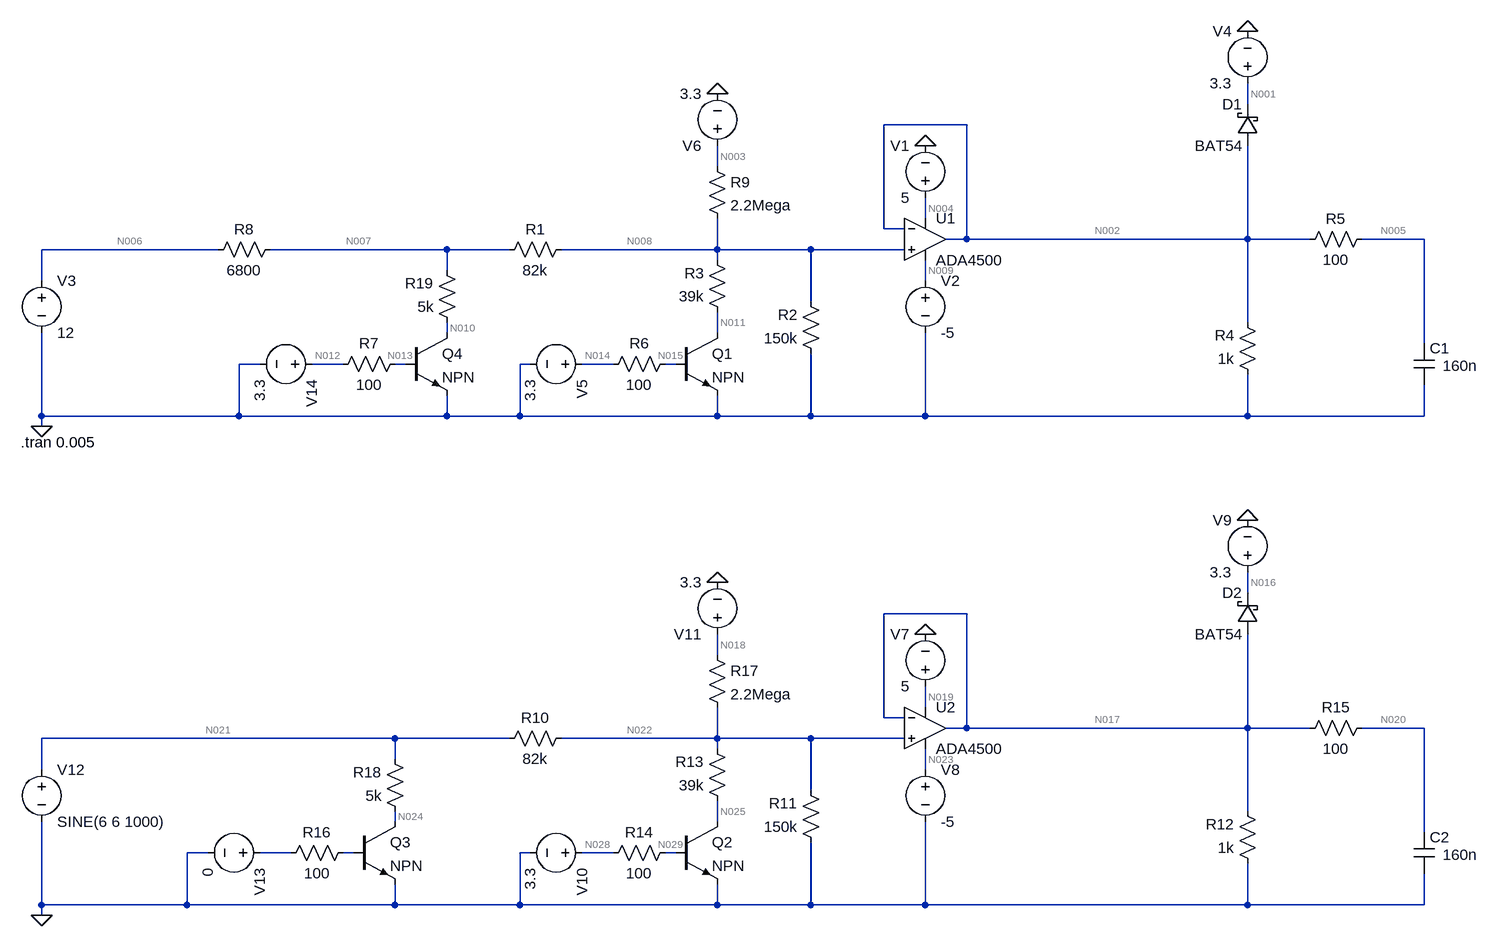
[diagram p0: schematic AnalogFrontend.asc]
AnalogFrontend.asc, the LTspice schematic file:
Version 4
SHEET 1 1180 1176
WIRE 752 -112 752 -144
WIRE 320 -80 192 -80
WIRE -64 -16 -64 -48
WIRE 256 64 256 32
WIRE 192 80 192 -80
WIRE 224 80 192 80
WIRE 320 96 320 -80
WIRE 320 96 288 96
WIRE 752 96 752 -48
WIRE 752 96 320 96
WIRE 848 96 752 96
WIRE 1024 96 928 96
WIRE -832 112 -1104 112
WIRE -480 112 -752 112
WIRE -384 112 -480 112
WIRE -64 112 -64 64
WIRE -64 112 -304 112
WIRE 80 112 -64 112
WIRE 224 112 80 112
WIRE -64 128 -64 112
WIRE -480 144 -480 112
WIRE -1104 160 -1104 112
WIRE 256 160 256 128
WIRE 80 192 80 112
WIRE 752 224 752 96
WIRE -480 240 -480 224
WIRE -64 240 -64 208
WIRE 1024 256 1024 96
WIRE -768 288 -800 288
WIRE -640 288 -688 288
WIRE -544 288 -560 288
WIRE -352 288 -368 288
WIRE -224 288 -272 288
WIRE -128 288 -144 288
WIRE -1104 368 -1104 240
WIRE -800 368 -800 288
WIRE -800 368 -1104 368
WIRE -480 368 -480 336
WIRE -480 368 -800 368
WIRE -368 368 -368 288
WIRE -368 368 -480 368
WIRE -64 368 -64 336
WIRE -64 368 -368 368
WIRE 80 368 80 272
WIRE 80 368 -64 368
WIRE 256 368 256 240
WIRE 256 368 80 368
WIRE 752 368 752 304
WIRE 752 368 256 368
WIRE 1024 368 1024 320
WIRE 1024 368 752 368
WIRE -1104 384 -1104 368
WIRE 752 640 752 608
WIRE 320 672 192 672
WIRE -64 736 -64 704
WIRE 256 816 256 784
WIRE 192 832 192 672
WIRE 224 832 192 832
WIRE 320 848 320 672
WIRE 320 848 288 848
WIRE 752 848 752 704
WIRE 752 848 320 848
WIRE 848 848 752 848
WIRE 1024 848 928 848
WIRE -560 864 -1104 864
WIRE -384 864 -560 864
WIRE -64 864 -64 816
WIRE -64 864 -304 864
WIRE 80 864 -64 864
WIRE 224 864 80 864
WIRE -64 880 -64 864
WIRE -560 896 -560 864
WIRE -1104 912 -1104 864
WIRE 256 912 256 880
WIRE 80 944 80 864
WIRE 752 976 752 848
WIRE -560 992 -560 976
WIRE -64 992 -64 960
WIRE 1024 1008 1024 848
WIRE -848 1040 -880 1040
WIRE -720 1040 -768 1040
WIRE -624 1040 -640 1040
WIRE -352 1040 -368 1040
WIRE -224 1040 -272 1040
WIRE -128 1040 -144 1040
WIRE -1104 1120 -1104 992
WIRE -880 1120 -880 1040
WIRE -880 1120 -1104 1120
WIRE -560 1120 -560 1088
WIRE -560 1120 -880 1120
WIRE -368 1120 -368 1040
WIRE -368 1120 -560 1120
WIRE -64 1120 -64 1088
WIRE -64 1120 -368 1120
WIRE 80 1120 80 1024
WIRE 80 1120 -64 1120
WIRE 256 1120 256 992
WIRE 256 1120 80 1120
WIRE 752 1120 752 1056
WIRE 752 1120 256 1120
WIRE 1024 1120 1024 1072
WIRE 1024 1120 752 1120
WIRE -1104 1136 -1104 1120
FLAG -1104 384 0
FLAG 256 -48 0
FLAG 752 -224 0
FLAG -64 -128 0
FLAG -1104 1136 0
FLAG 256 704 0
FLAG 752 528 0
FLAG -64 624 0
SYMBOL res -288 96 R90
WINDOW 0 0 56 VBottom 2
WINDOW 3 32 56 VTop 2
SYMATTR InstName R1
SYMATTR Value 82k
SYMBOL res 96 288 R180
WINDOW 0 36 76 Left 2
WINDOW 3 36 40 Left 2
SYMATTR InstName R2
SYMATTR Value 150k
SYMBOL OpAmps\\ADA4500 256 32 R0
SYMATTR InstName U1
SYMBOL voltage 256 48 R180
WINDOW 0 24 96 Left 2
WINDOW 3 24 16 Left 2
WINDOW 123 0 0 Left 0
WINDOW 39 0 0 Left 0
SYMATTR InstName V1
SYMATTR Value 5
SYMBOL voltage 256 144 R0
WINDOW 123 0 0 Left 0
WINDOW 39 0 0 Left 0
SYMATTR InstName V2
SYMATTR Value -5
SYMBOL res 768 320 R180
WINDOW 0 36 76 Left 2
WINDOW 3 36 40 Left 2
SYMATTR InstName R4
SYMATTR Value 1k
SYMBOL cap 1008 256 R0
WINDOW 3 44 35 Left 2
SYMATTR Value 160n
SYMATTR InstName C1
SYMBOL schottky 768 -48 R180
WINDOW 0 24 64 Left 2
WINDOW 3 24 0 Left 2
SYMATTR InstName D1
SYMATTR Value BAT54
SYMATTR Description Diode
SYMATTR Type diode
SYMBOL voltage 752 -128 R180
WINDOW 0 24 96 Left 2
WINDOW 3 24 16 Left 2
WINDOW 123 0 0 Left 0
WINDOW 39 0 0 Left 0
SYMATTR InstName V4
SYMATTR Value 3.3
SYMBOL res -48 224 R180
WINDOW 0 36 76 Left 2
WINDOW 3 36 40 Left 2
SYMATTR InstName R3
SYMATTR Value 39k
SYMBOL npn -128 240 R0
SYMATTR InstName Q1
SYMBOL res -128 272 R90
WINDOW 0 0 56 VBottom 2
WINDOW 3 32 56 VTop 2
SYMATTR InstName R6
SYMATTR Value 100
SYMBOL voltage -256 288 R90
WINDOW 123 0 0 Left 0
WINDOW 39 0 0 Left 0
SYMATTR InstName V5
SYMATTR Value 3.3
SYMBOL res 944 80 R90
WINDOW 0 0 56 VBottom 2
WINDOW 3 32 56 VTop 2
SYMATTR InstName R5
SYMATTR Value 100
SYMBOL res -736 96 R90
WINDOW 0 0 56 VBottom 2
WINDOW 3 32 56 VTop 2
SYMATTR InstName R8
SYMATTR Value 6800
SYMBOL res -80 -32 R0
SYMATTR InstName R9
SYMATTR Value 2.2Mega
SYMBOL voltage -64 -32 R180
WINDOW 123 0 0 Left 0
WINDOW 39 0 0 Left 0
SYMATTR InstName V6
SYMATTR Value 3.3
SYMBOL voltage -1104 144 R0
WINDOW 123 0 0 Left 0
WINDOW 39 0 0 Left 0
SYMATTR InstName V3
SYMATTR Value 12
SYMBOL res -288 848 R90
WINDOW 0 0 56 VBottom 2
WINDOW 3 32 56 VTop 2
SYMATTR InstName R10
SYMATTR Value 82k
SYMBOL res 96 1040 R180
WINDOW 0 36 76 Left 2
WINDOW 3 36 40 Left 2
SYMATTR InstName R11
SYMATTR Value 150k
SYMBOL OpAmps\\ADA4500 256 784 R0
SYMATTR InstName U2
SYMBOL voltage 256 800 R180
WINDOW 0 24 96 Left 2
WINDOW 3 24 16 Left 2
WINDOW 123 0 0 Left 0
WINDOW 39 0 0 Left 0
SYMATTR InstName V7
SYMATTR Value 5
SYMBOL voltage 256 896 R0
WINDOW 123 0 0 Left 0
WINDOW 39 0 0 Left 0
SYMATTR InstName V8
SYMATTR Value -5
SYMBOL res 768 1072 R180
WINDOW 0 36 76 Left 2
WINDOW 3 36 40 Left 2
SYMATTR InstName R12
SYMATTR Value 1k
SYMBOL cap 1008 1008 R0
WINDOW 3 44 35 Left 2
SYMATTR Value 160n
SYMATTR InstName C2
SYMBOL schottky 768 704 R180
WINDOW 0 24 64 Left 2
WINDOW 3 24 0 Left 2
SYMATTR InstName D2
SYMATTR Value BAT54
SYMATTR Description Diode
SYMATTR Type diode
SYMBOL voltage 752 624 R180
WINDOW 0 24 96 Left 2
WINDOW 3 24 16 Left 2
WINDOW 123 0 0 Left 0
WINDOW 39 0 0 Left 0
SYMATTR InstName V9
SYMATTR Value 3.3
SYMBOL res -48 976 R180
WINDOW 0 36 76 Left 2
WINDOW 3 36 40 Left 2
SYMATTR InstName R13
SYMATTR Value 39k
SYMBOL npn -128 992 R0
SYMATTR InstName Q2
SYMBOL res -128 1024 R90
WINDOW 0 0 56 VBottom 2
WINDOW 3 32 56 VTop 2
SYMATTR InstName R14
SYMATTR Value 100
SYMBOL voltage -256 1040 R90
WINDOW 123 0 0 Left 0
WINDOW 39 0 0 Left 0
SYMATTR InstName V10
SYMATTR Value 3.3
SYMBOL res 944 832 R90
WINDOW 0 0 56 VBottom 2
WINDOW 3 32 56 VTop 2
SYMATTR InstName R15
SYMATTR Value 100
SYMBOL res -80 720 R0
SYMATTR InstName R17
SYMATTR Value 2.2Mega
SYMBOL voltage -64 720 R180
WINDOW 123 0 0 Left 0
WINDOW 39 0 0 Left 0
SYMATTR InstName V11
SYMATTR Value 3.3
SYMBOL voltage -1104 896 R0
WINDOW 123 0 0 Left 0
WINDOW 39 0 0 Left 0
SYMATTR InstName V12
SYMATTR Value SINE(6 6 1000)
SYMBOL res -624 1024 R90
WINDOW 0 0 56 VBottom 2
WINDOW 3 32 56 VTop 2
SYMATTR InstName R16
SYMATTR Value 100
SYMBOL voltage -752 1040 R90
WINDOW 123 0 0 Left 0
WINDOW 39 0 0 Left 0
SYMATTR InstName V13
SYMATTR Value 0
SYMBOL res -544 992 R180
WINDOW 0 36 76 Left 2
WINDOW 3 36 40 Left 2
SYMATTR InstName R18
SYMATTR Value 5k
SYMBOL npn -624 992 R0
SYMATTR InstName Q3
SYMBOL res -544 272 R90
WINDOW 0 0 56 VBottom 2
WINDOW 3 32 56 VTop 2
SYMATTR InstName R7
SYMATTR Value 100
SYMBOL voltage -672 288 R90
WINDOW 123 0 0 Left 0
WINDOW 39 0 0 Left 0
SYMATTR InstName V14
SYMATTR Value 3.3
SYMBOL res -464 240 R180
WINDOW 0 36 76 Left 2
WINDOW 3 36 40 Left 2
SYMATTR InstName R19
SYMATTR Value 5k
SYMBOL npn -544 240 R0
SYMATTR InstName Q4
TEXT -1136 408 Left 2 !.tran 0.005

The netlist it stands for:
* AnalogFrontend.asc
R1 N008 N007 82k
R2 0 N008 150k
XU1 N008 N002 N004 N009 N002 ADA4500  ; pins In+ In- V+ V- OUT
V1 N004 0 5
V2 N009 0 -5
R4 0 N002 1k
C1 N005 0 160n
D1 N002 N001 BAT54
V4 N001 0 3.3
R3 N011 N008 39k
Q1 N011 N015 0 0 NPN
R6 N015 N014 100
V5 N014 0 3.3
R5 N005 N002 100
R8 N007 N006 6800
R9 N003 N008 2.2Mega
V6 N003 0 3.3
V3 N006 0 12
R10 N022 N021 82k
R11 0 N022 150k
XU2 N022 N017 N019 N023 N017 ADA4500  ; pins In+ In- V+ V- OUT
V7 N019 0 5
V8 N023 0 -5
R12 0 N017 1k
C2 N020 0 160n
D2 N017 N016 BAT54
V9 N016 0 3.3
R13 N025 N022 39k
Q2 N025 N029 0 0 NPN
R14 N029 N028 100
V10 N028 0 3.3
R15 N020 N017 100
R17 N018 N022 2.2Mega
V11 N018 0 3.3
V12 N021 0 SINE(6 6 1000)
R16 N027 N026 100
V13 N026 0 0
R18 N024 N021 5k
Q3 N024 N027 0 0 NPN
R7 N013 N012 100
V14 N012 0 3.3
R19 N010 N007 5k
Q4 N010 N013 0 0 NPN
.model D D
.lib standard.dio
.model NPN NPN
.model PNP PNP
.lib standard.bjt
.tran 0.005
.backanno
.end

* Results of the author's LTspice run, read from the files saved beside the schematic
* Operating Point, zero values left out:
*   V(n008) = 1.392 V
*   V(n007) = 4.97 V
*   V(n004) = 5 V
*   V(n002) = 1.392 V
*   V(n009) = -5 V
*   V(n005) = 1.392 V
*   V(n001) = 3.3 V
*   V(n011) = 17.95 mV
*   V(n015) = 874.1 mV
*   V(n014) = 3.3 V
*   V(n006) = 12 V
*   V(n003) = 3.3 V
*   V(n022) = 1.671 V
*   V(n021) = 6 V
*   V(n019) = 5 V
*   V(n017) = 1.671 V
*   V(n023) = -5 V
*   V(n020) = 1.671 V
*   V(n016) = 3.3 V
*   V(n025) = 17.95 mV
*   V(n029) = 874.1 mV
*   V(n028) = 3.3 V
*   V(n018) = 3.3 V
*   V(n024) = 6 V
*   V(n013) = 874.6 mV
*   V(n012) = 3.3 V
*   V(n010) = 18.46 mV
*   Ic(Q4) = 990.2 µA
*   Ib(Q4) = 24.25 mA
*   Ie(Q4) = -25.24 mA
*   Ic(Q3) = 6 pA
*   Ib(Q3) = -6 pA
*   Ic(Q2) = 42.39 µA
*   Ib(Q2) = 24.26 mA
*   Ie(Q2) = -24.3 mA
*   Ic(Q1) = 35.22 µA
*   Ib(Q1) = 24.26 mA
*   Ie(Q1) = -24.29 mA
*   I(D2) = -100 nA
*   I(D1) = -100 nA
*   I(R19) = -990.2 µA
*   I(R7) = -24.25 mA
*   I(R18) = -6 pA
*   I(R16) = 6 pA
*   I(R17) = 740.4 nA
*   I(R14) = -24.26 mA
*   I(R13) = -42.39 µA
*   I(R12) = -1.671 mA
*   I(R11) = -11.14 µA
*   I(R10) = -52.79 µA
*   I(R9) = 867.4 nA
*   I(R8) = -1.034 mA
*   I(R6) = -24.26 mA
*   I(R3) = -35.22 µA
*   I(R4) = -1.392 mA
*   I(R2) = -9.278 µA
*   I(R1) = -43.63 µA
*   I(V14) = -24.25 mA
*   I(V13) = 6 pA
*   I(V12) = -52.79 µA
*   I(V11) = -740.4 nA
*   I(V10) = -24.26 mA
*   I(V9) = -100 nA
*   I(V8) = 1.298 A
*   I(V7) = -1.3 A
*   I(V3) = -1.034 mA
*   I(V6) = -867.4 nA
*   I(V5) = -24.26 mA
*   I(V4) = -100 nA
*   I(V2) = 1.298 A
*   I(V1) = -1.299 A
*   Ix(u1:1) = 2.784 pA
*   Ix(u1:2) = 2.784 pA
*   Ix(u1:99) = 1.299 A
*   Ix(u1:50) = -1.298 A
*   Ix(u1:45) = -1.391 mA
*   Ix(u2:1) = 3.343 pA
*   Ix(u2:2) = 3.342 pA
*   Ix(u2:99) = 1.3 A
*   Ix(u2:50) = -1.298 A
*   Ix(u2:45) = -1.671 mA
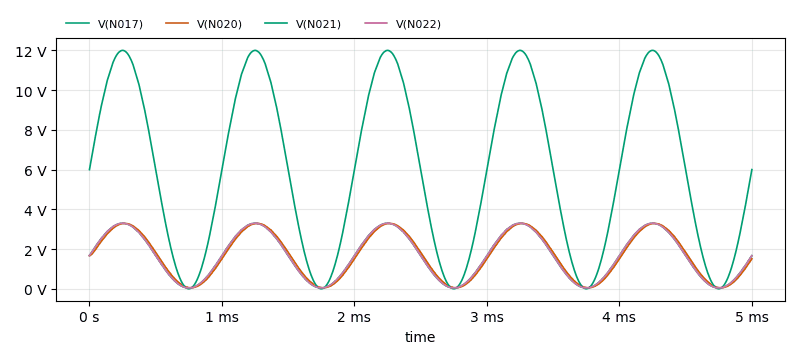
[diagram p1: Transient Analysis of AnalogFrontend.asc, plotted from the saved traces]
* Transient Analysis, 1 run:
*   V(N017): min 43.97 mV, max 3.298 V, average 1.669 V, rms 2.029 V, last 1.67 V
*   V(N020): min 52.12 mV, max 3.29 V, average 1.67 V, rms 2.026 V, last 1.508 V
*   V(N021): min 13.82 µV, max 12 V, average 5.994 V, rms 7.348 V, last 6 V
*   V(N022): min 43.98 mV, max 3.298 V, average 1.67 V, rms 2.029 V, last 1.671 V